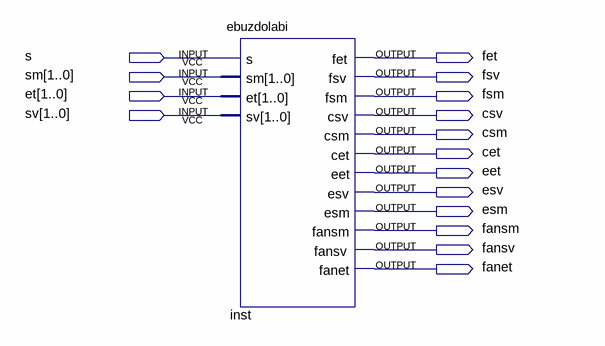
[diagram p0: schematic sheet]
// Quartus schematic buzdooo.bdf as structural Verilog: 1 symbols, 16 pins
module buzdooo (
  input  s,
  input  [1:0] sm,
  input  [1:0] et,
  input  [1:0] sv,
  output fet,
  output fsv,
  output fsm,
  output csv,
  output csm,
  output cet,
  output eet,
  output esv,
  output esm,
  output fansm,
  output fansv,
  output fanet
);

  ebuzdolabi inst (
    .s(s), .sm(sm), .et(et), .sv(sv), .fet(fet), .fsv(fsv), .fsm(fsm), .csv(csv), .csm(csm), .cet(cet),
    .eet(eet), .esv(esv), .esm(esm), .fansm(fansm), .fansv(fansv), .fanet(fanet));
endmodule
